# EAGLE design REV SPARC CNC with battery (EAGLE 9.6.2)
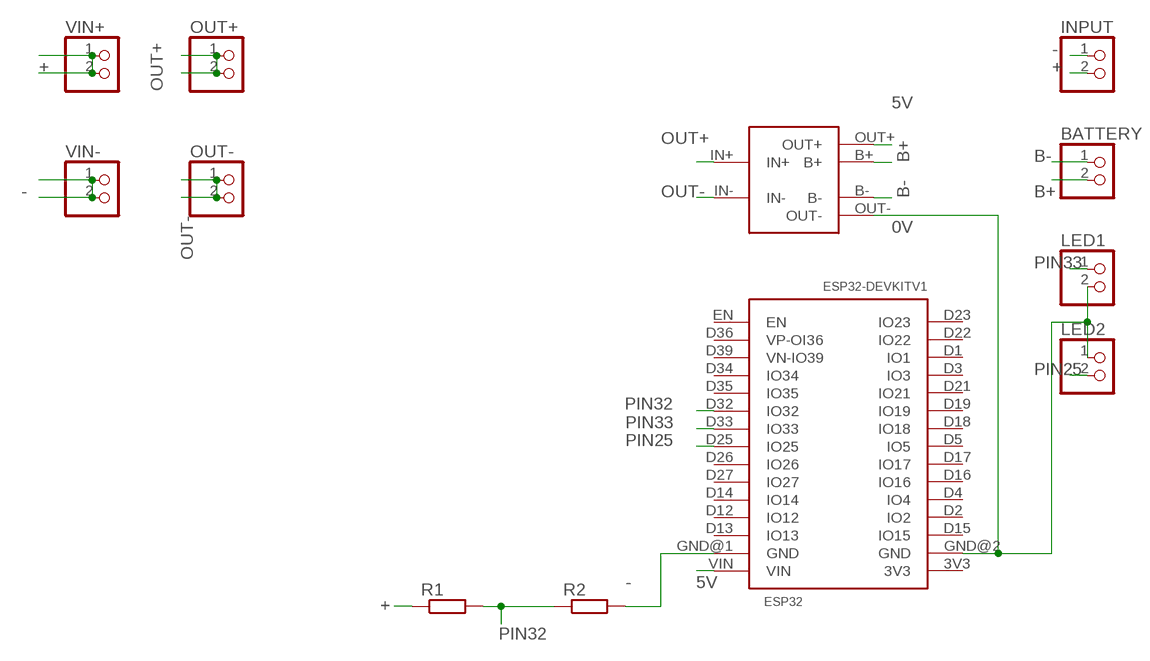
[diagram p0: schematic, sheet 1]

## Parts
BATTERY  PINHD-1X02_2.54  [1X02]
ESP32  ESP32DEVKITV1  [ESP32-DEVKITV1]
INPUT  PINHD-1X2  [1X02]
LED1  PINHD-1X2  [1X02]
LED2  PINHD-1X2  [1X02]
OUT+  PINHD-1X2  [1X02]
OUT-  PINHD-1X2  [1X02]
R1  R-EU_0207/10  [0207/10]
R2  R-EU_0207/10  [0207/10]
TP  TP4056-PTH  [TP4056-PTH]
VIN+  PINHD-1X2  [1X02]
VIN-  PINHD-1X2  [1X02]

## Nets
0V: ESP32.GND@2(GND) LED1.2 LED2.1 TP.OUT-
5V: ESP32.VIN TP.OUT+
+: INPUT.2 R1.1 VIN+.1 VIN+.2
-: ESP32.GND@1(GND) INPUT.1 R2.2 VIN-.1 VIN-.2
B+: BATTERY.2 TP.B+
B-: BATTERY.1 TP.B-
OUT+: OUT+.1 OUT+.2 TP.IN+
OUT-: OUT-.1 OUT-.2 TP.IN-
PIN25: ESP32.D25(IO25) LED2.2
PIN32: ESP32.D32(IO32) R1.2 R2.1
PIN33: ESP32.D33(IO33) LED1.1
Unconnected: ESP32.3V3 ESP32.D1(IO1) ESP32.D2(IO2) ESP32.D3(IO3) ESP32.D4(IO4) ESP32.D5(IO5) ESP32.D12(IO12) ESP32.D13(IO13) ESP32.D14(IO14) ESP32.D15(IO15) ESP32.D16(IO16) ESP32.D17(IO17) ESP32.D18(IO18) ESP32.D19(IO19) ESP32.D21(IO21) ESP32.D22(IO22) ESP32.D23(IO23) ESP32.D26(IO26) ESP32.D27(IO27) ESP32.D34(IO34) ESP32.D35(IO35) ESP32.D36(VP-OI36) ESP32.D39(VN-IO39) ESP32.EN

## Library data of the parts
BATTERY = pinhead-2:PINHD-1X02: PIN HEADER
ESP32 = ESP32-DEVKITV1:ESP32DEVKITV1
INPUT LED1 LED2 OUT+ OUT- VIN+ VIN- = pinhead:PINHD-1X2: PIN HEADER
R1 R2 = resistor:R-EU_: RESISTOR, European symbol
TP = 32teeth - TP4056 Module:TP4056-PTH

## Board
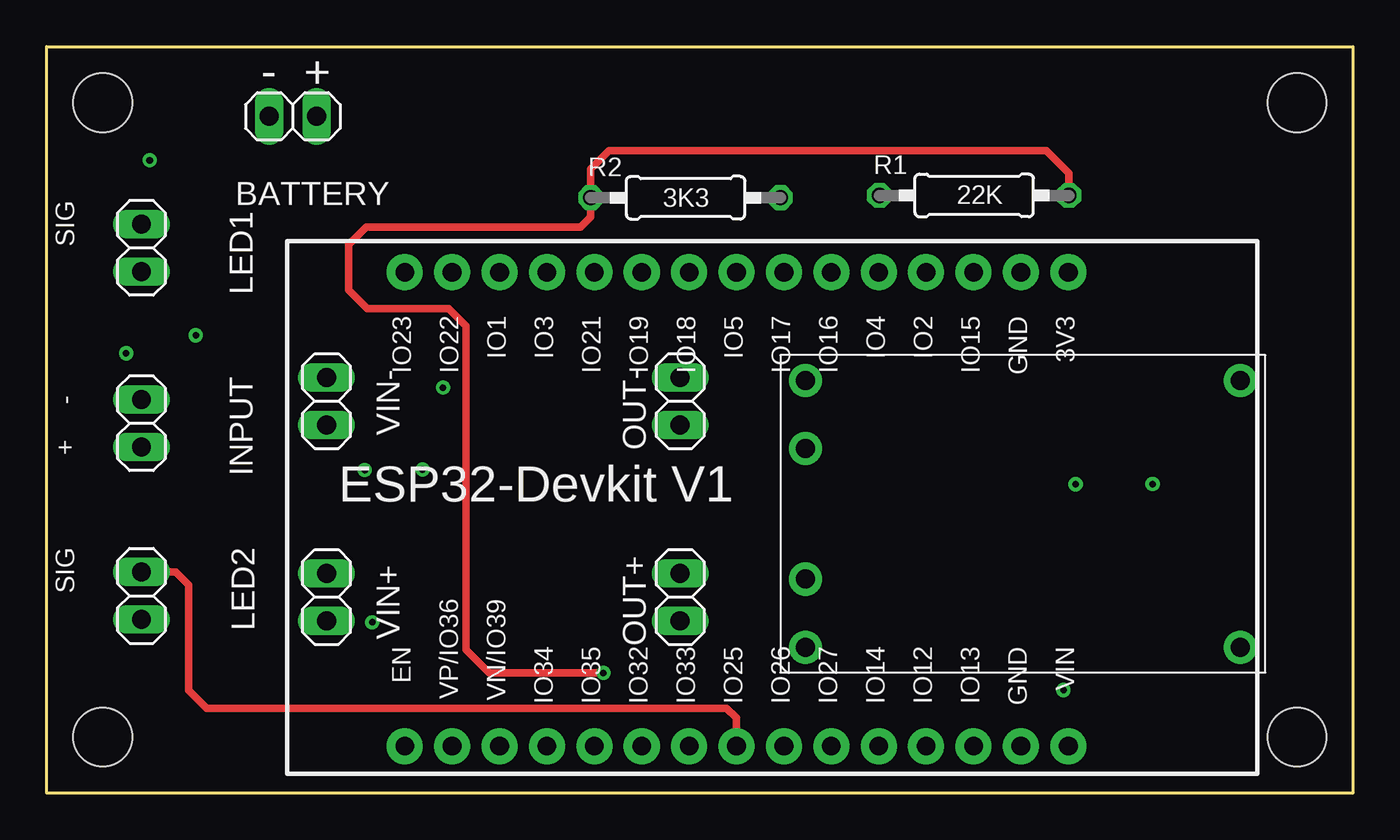
[diagram p1: board, top side]
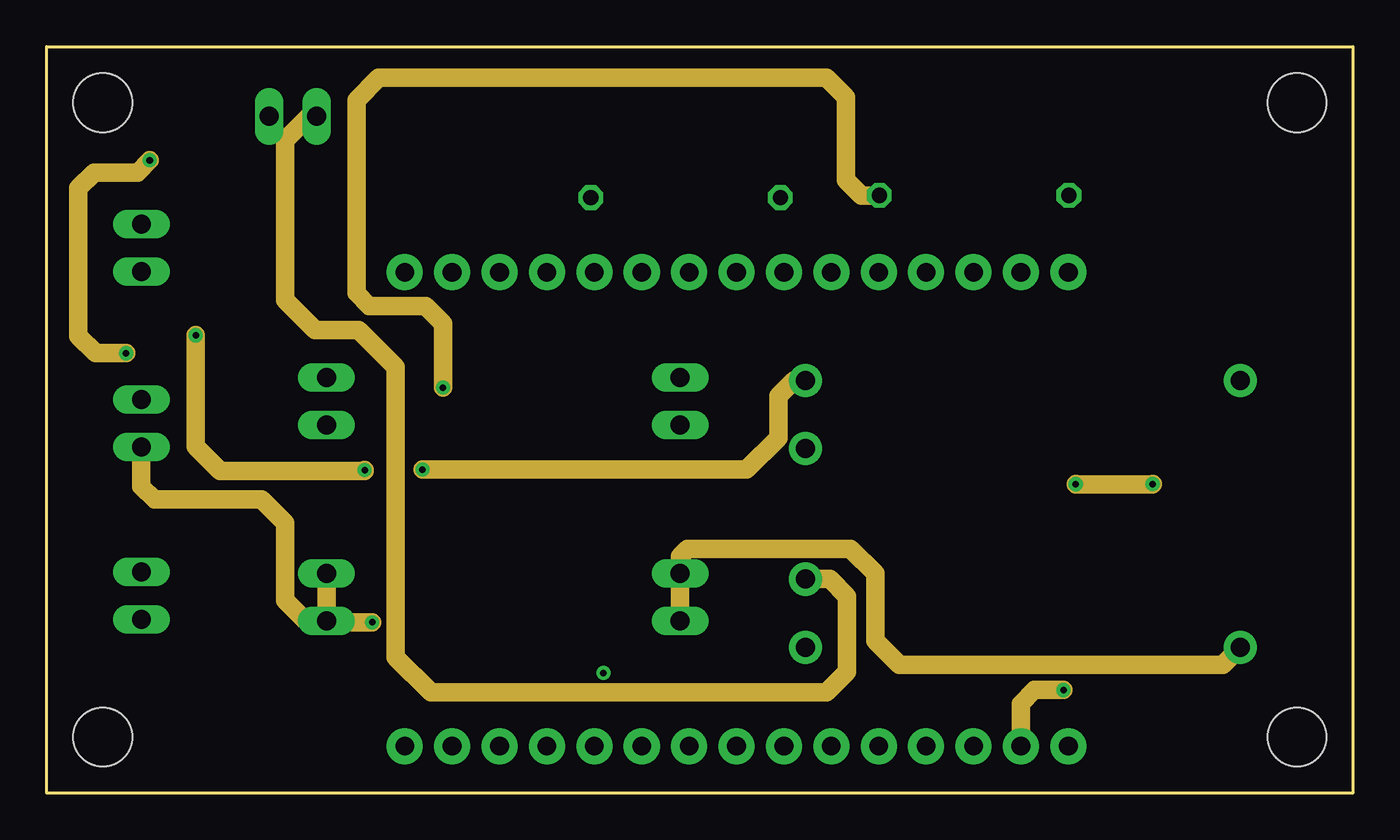
[diagram p2: board, inner layer Route2]
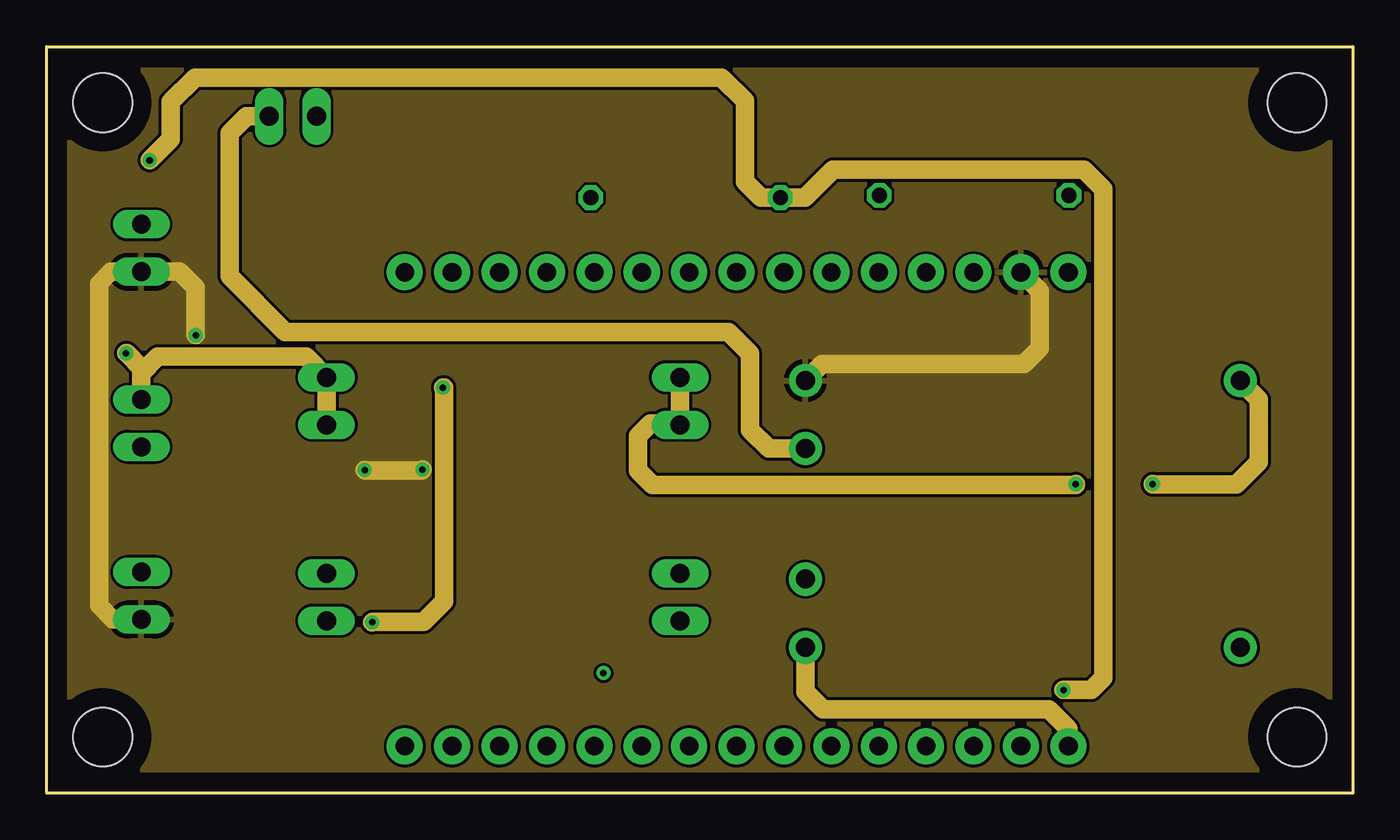
[diagram p3: board, inner layer Route15]
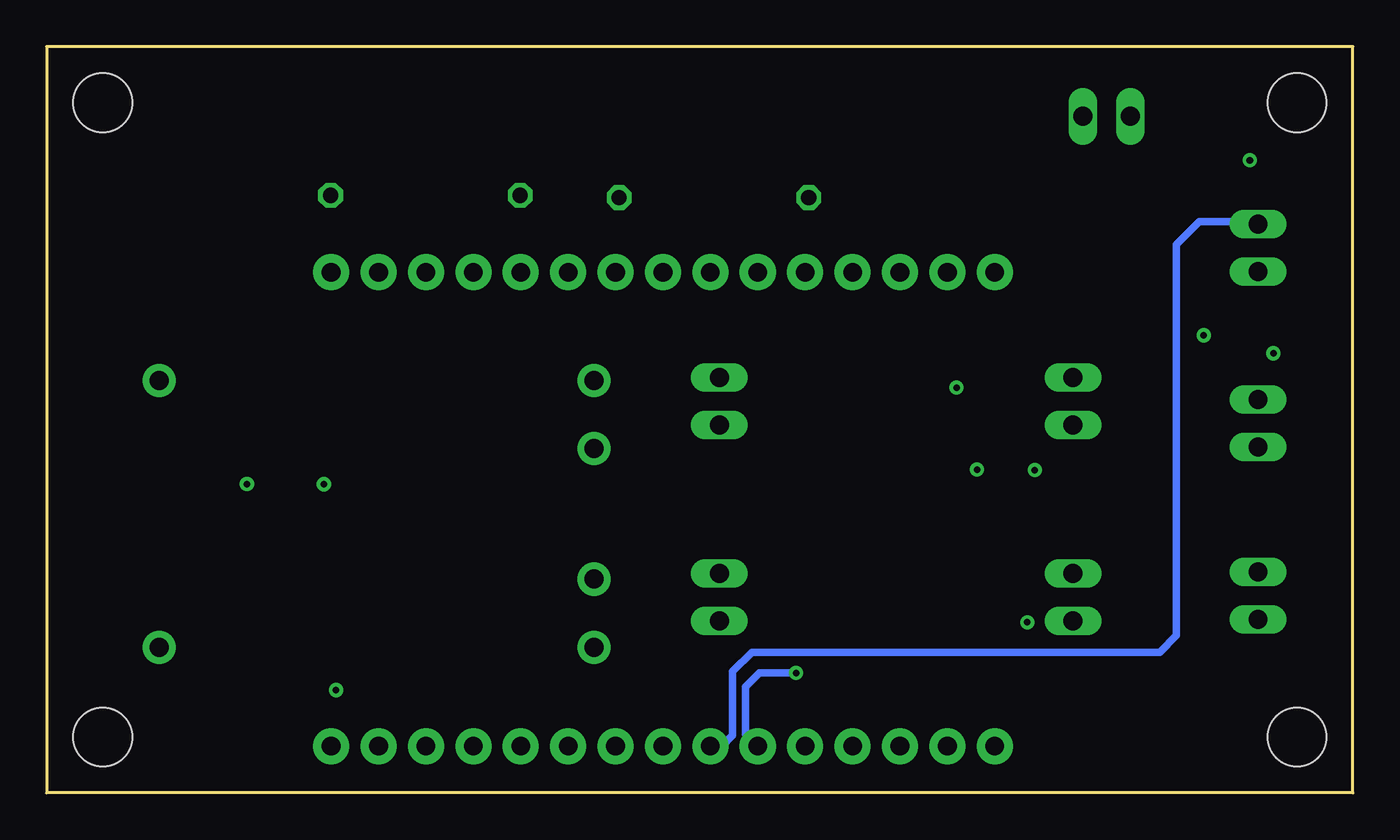
[diagram p4: board, bottom side, seen from below]

Size 70 x 40 mm. Coordinates in mm from the lower left corner, seen from the top.
Outline: 0,0 70,0 70,40 0,40 0,0
Copper layers (1+2*15+16): Top 0.035mm / dielectric 1.5mm / Route2 0.035mm / dielectric 0.15mm / Route15 0.035mm / dielectric 0.2mm / Bottom 0.035mm
Design rules "default *": minimum track width 6mil, minimum drill 0.35mm, track to track 6mil, track to pad 6mil, pad to pad 6mil, via to via 6mil, smd to smd 6mil, copper to edge 40mil, drill to drill 6mil, minimum pad ring 10mil, minimum via ring 8mil, stop-mask expansion 4mil, vias tented up to drill 0mil, thermal gap 10mil
Holes 3.15 mm at 3,37 67,37 3,3 67,3

### Footprints (pad centres in the part's own frame; a part is rotated, then mirrored left to right if it is on the bottom)
1X02 = drill 1.016 long: 1 -1.27,0; 2 1.27,0
ESP32-DEVKITV1 = drill 1 pad 1.93: 3V3 -16.52,-12.27; D1 13.96,-12.27; D2 -8.9,-12.27; D3 11.42,-12.27; D4 -6.36,-12.27; D5 1.26,-12.27; D12 -8.9,13.135; D13 -11.44,13.135; D14 -6.36,13.135; D15 -11.44,-12.27; D16 -3.82,-12.27; D17 -1.28,-12.27; D18 3.8,-12.27; D19 6.34,-12.27; D21 8.88,-12.27; D22 16.5,-12.27; D23 19.04,-12.27; D25 1.26,13.135; D26 -1.28,13.135; D27 -3.82,13.135; D32 6.34,13.135; D33 3.8,13.135; D34 11.42,13.135; D35 8.88,13.135; D36 16.5,13.135; D39 13.96,13.135; EN 19.04,13.135; GND@1 -13.98,13.135; GND@2 -13.98,-12.27; VIN -16.52,13.135
0207/10 = drill 0.813 octagon: 1 -5.08,0; 2 5.08,0
TP4056-PTH = drill 1.016 pad 1.778: B+ 12,1.35; B- 5,1.35; IN+ 15.65,24.65; IN- 1.35,24.65; OUT+ 15.65,1.35; OUT- 1.35,1.35

### Placement (x,y rotation side)
BATTERY  13.2,36.26 0 top
ESP32  38.23,15.64 180 top
INPUT  5.08,19.81 270 top
LED1  5.08,29.21 270 top
LED2  5.08,10.57 90 top
OUT+  33.95,10.5 90 top
OUT-  33.95,21 90 top
R1  49.7,32.02 0 top
R2  34.24,31.9 0 top
TP  39.31,23.46 270 top
VIN+  15,10.5 90 top
VIN-  15,21 90 top

### Tracks (layer width: path | path; a pad name or v marks a point on that pad's centre or on a via)
0V  (via drill 0.35)
  Route2 1: v8,24.53 8,18.56 9.29,17.26 17.05,17.26 v17.05,17.31 | v20.15,17.33 v20.15,17.32 37.52,17.32 39.22,19.02 39.22,21.26 40.06,22.11 TP.OUT-
  Route15 1: LED2.1 3.55,9.3 2.81,10.04 2.81,27.31 3.44,27.94 LED1.2 7.13,27.94 8,27.07 v8,24.53 | v20.15,17.33 20.11,17.29 17.06,17.29 v17.05,17.31 | TP.OUT- 41.54,22.99 52.37,22.99 53.23,23.84 53.23,26.89 ESP32.GND@2
  pour Route15: 0,0 0,40 70,40 70,0
5V
  Route15 1: TP.OUT+ 40.66,5.41 41.59,4.48 53.7,4.48 54.75,3.43 ESP32.VIN
+  (via drill 0.35)
  Route2 1: INPUT.2 5.08,16.42 5.78,15.72 11.52,15.72 12.78,14.46 12.78,10.32 13.87,9.24 14.98,9.24 VIN+.1 | v21.24,21.72 21.24,21.81 21.26,21.83 21.26,25.15 20.31,26.09 17.29,26.09 16.6,26.79 16.6,37.14 17.8,38.34 41.78,38.34 42.85,37.28 42.85,32.84 43.66,32.02 R1.1 | VIN+.2 VIN+.1 | v17.45,9.15 15.08,9.15 VIN+.1
  Route15 1: v17.45,9.15 v17.46,9.15 20.2,9.15 21.31,10.26 21.31,21.72 v21.24,21.72
-  (via drill 0.35)
  Route2 1: v4.26,23.56 2.62,23.56 1.7,24.48 1.7,32.41 2.55,33.26 4.87,33.26 v5.52,33.91 | v54.49,5.51 52.94,5.51 52.21,4.78 ESP32.GND@1
  Route15 1: 5.06,22.48 5.95,23.38 13.89,23.38 VIN-.2 VIN-.1 | INPUT.1 5.06,21.1 5.06,22.48 | 5.06,22.48 5.06,22.79 4.28,23.56 v4.26,23.56 | v5.52,33.91 6.65,35.04 6.65,37.04 7.96,38.35 36.17,38.35 37.42,37.1 37.42,32.76 38.27,31.9 R2.2 40.65,31.9 42.15,33.4 55.58,33.4 56.62,32.36 56.62,6.16 55.99,5.53 54.51,5.53 v54.49,5.51
B+
  Route2 1: BATTERY.2 14.06,36.26 12.77,34.97 12.78,26.41 14.38,24.81 16.73,24.81 18.71,22.82 18.71,7.27 20.59,5.39 41.79,5.39 42.89,6.49 42.89,10.53 41.96,11.46 TP.B+
B-
  Route15 1: TP.B- 38.7,18.46 37.7,19.45 37.7,23.54 36.55,24.7 12.79,24.7 9.8,27.69 9.8,35.35 10.71,36.26 BATTERY.1
OUT+
  Route2 1: TP.IN+ 63.03,6.87 45.69,6.87 44.41,8.15 44.41,11.76 43.09,13.08 34.34,13.08 33.94,12.68 33.94,11.78 OUT+.2 OUT+.1
OUT-  (via drill 0.35)
  Route2 1: v59.27,16.55 59.24,16.52 55.16,16.52 v55.14,16.55
  Route15 1: TP.IN- 64.97,21.1 64.97,17.74 63.77,16.53 59.29,16.53 v59.27,16.55 | v55.14,16.55 55.14,16.5 32.47,16.5 31.7,17.28 31.7,19.13 32.36,19.79 33.89,19.79 | 33.89,19.79 OUT-.1 | OUT-.2 33.95,19.86 33.89,19.79
PIN25
  Top 0.4: LED2.2 6.92,11.84 7.62,11.14 7.62,5.49 8.57,4.54 36.45,4.54 36.97,4.01 ESP32.D25
PIN32  (via drill 0.35)
  Top 0.4: R1.2 54.78,33.21 53.57,34.42 30.15,34.42 29.16,33.43 R2.1 29.16,30.87 28.61,30.33 17.11,30.33 16.18,29.39 16.18,26.96 17.18,25.96 21.54,25.96 22.48,25.02 22.48,7.67 23.72,6.44 29.82,6.44 v29.84,6.42
  Bottom 0.4: v29.84,6.42 31.81,6.42 32.54,5.69 32.54,3.15 ESP32.D32
PIN33
  Bottom 0.4: LED1.1 5.21,30.61 8.24,30.61 9.45,29.4 9.45,8.44 10.35,7.54 32.2,7.54 33.24,6.5 33.24,3.08 33.82,2.5 ESP32.D33

### Text on the board
tPlace: 22K | 3K3 | SIG | - | + | SIG
tNames: - | +